# Altium project InterruptorPIR.PrjPCB
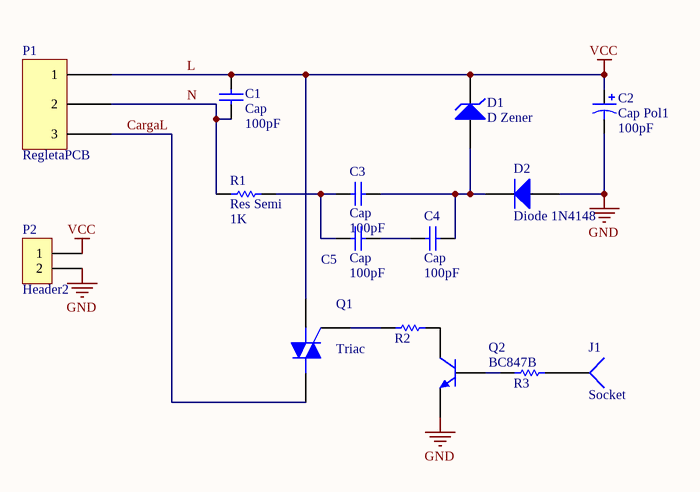
[diagram p0: FuenteAlimentacion.SchDoc]
1 sheet, 15 parts. Net scope: global (net labels, ports and power ports of the same name join across sheets).
Board file: InterruptorPIR.PcbDoc

## Sheet FuenteAlimentacion.SchDoc
size A4

### Parts
C1  Cap  value 100pF  [CAPR5.08-7.8x3.2]
C2  Cap Pol1  value 100pF  [CAPPR2-5x6.8]
C3  Cap  value 100pF  [CAP400V]
C4  Cap  value 100pF  [CAP250V]
C5  Cap  value 100pF  [CAP250V]
D1  D Zener  [Zener]
D2  Diode 1N4148  [1N4148SMD]
J1  Socket  [PIN1]
P1  RegletaPCB  [RegletaPCBx3]
P2  Header2  [Header2Macho]
Q1  Triac  [SFM-T3/A2.4V]
Q2  BC847B  [SOT23_N]
R1  Res Semi  value 1K  [AXIAL-0.5]
R2  Resistor  [0805_RES]  (value not drawn)
R3  Resistor  [0805_RES]  (value not drawn)

### Nets
GND: C2.2 D2.1(A) P2.2 Q2.2(E)
L: C1.2 C2.1 D1.2(K) P1.1 P2.1 Q1.1(M1)  [also labelled VCC]
CargaL: P1.3 Q1.2(M2)
N: C1.1 P1.2 R1.1
NetC3_1: C3.1 C5.1 R1.2
NetC3_2: C3.2 C4.2 D1.1(A) D2.2(K)
NetC4_1: C4.1 C5.2
NetJ1_1: J1.1 R3.2
NetQ1_3: Q1.3(G) R2.1
NetQ2_1: Q2.1(B) R3.1
NetQ2_3: Q2.3(C) R2.2

### Library data of the parts
C1 C3-C5 = Cap: Capacitor; Published: 8-Jun-2000; LatestRevisionDate: 17-Jul-2002; LatestRevisionNote: Re-released for DXP Platform.; PackageReference: RAD-0.3; Publisher: Altium Limited
C2 = Cap Pol1: Polarized Capacitor (Radial); Published: 8-Jun-2000; LatestRevisionDate: 17-Jul-2002; LatestRevisionNote: Re-released for DXP Platform.; PackageReference: RB7.6-15; Publisher: Altium Limited
D1 = D Zener: Zener Diode; Published: 8-Jun-2000; LatestRevisionDate: 17-Jul-2002; LatestRevisionNote: Re-released for DXP Platform.; PackageReference: DIODE-0.7; Publisher: Altium Limited
D2 = Diode 1N4148: High Conductance Fast Diode; Published: 8-Jun-2000; LatestRevisionDate: 17-Jul-2002; LatestRevisionNote: Re-released for DXP Platform.; DatasheetVersion: 1997; PackageReference: DO-35; Publisher: Altium Limited; Code_JEDEC: DO-204-AH; ComponentLink1Description: Manufacturer Link; ComponentLink1URL: http://www.fairchildsemi.com/; ComponentLink2Description: Datasheet; ComponentLink2URL: http://www.fairchildsemi.com/ds/1N%2F1N4148.pdf
P1 = RegletaPCBx3
Q1 = Triac: Silicon Bidirectional Triode Thyristor; Note: Pin 2 is electrically connected to Pin 4 (TAB); Published: 29-Sep-2000; LatestRevisionDate: 17-Jul-2002; LatestRevisionNote: Re-released for DXP Platform.; DatasheetVersion: 1999; PackageReference: 369-03; Publisher: Altium Limited; Code_JEDEC: TO-251-AA; ComponentLink1Description: Manufacturer Link; ComponentLink1URL: http://www.motorola.com/
Q2 = BC847B: NPN General-purpose Transistor; Published: 17-Sep-2003; LatestRevisionDate: 12-Dec-2006; LatestRevisionNote: IPC-7351 Footprint Added.; DatasheetVersion: 4-Feb-2002; PackageVersion: May-1999; PackageReference: SOT23; Publisher: Altium Limited; PackageDescription: 3-Pin SOT-23 Package 0.95 mm Pitch, 2.3 mm Lead Span; ComponentLink1Description: Manufacturer Link; ComponentLink1URL: http://www.semiconductors.philips.com/; ComponentLink2Description: Datasheet; ComponentLink2URL: http://www.semiconductors.philips.com/acrobat/datasheets/BC846_BC847_BC848_5.pdf
R1 = Res Semi: Semiconductor Resistor; Published: 8-Jun-2000; LatestRevisionDate: 17-Jul-2002; LatestRevisionNote: Re-released for DXP Platform.; PackageReference: AXIAL-0.5; Publisher: Altium Limited
R2 R3 = Res
J1 = Socket: LatestRevisionDate: 17-Jul-2002; LatestRevisionNote: Re-released for DXP Platform.; Publisher: Altium Limited